# EAGLE design untitled (EAGLE 9.6.2)
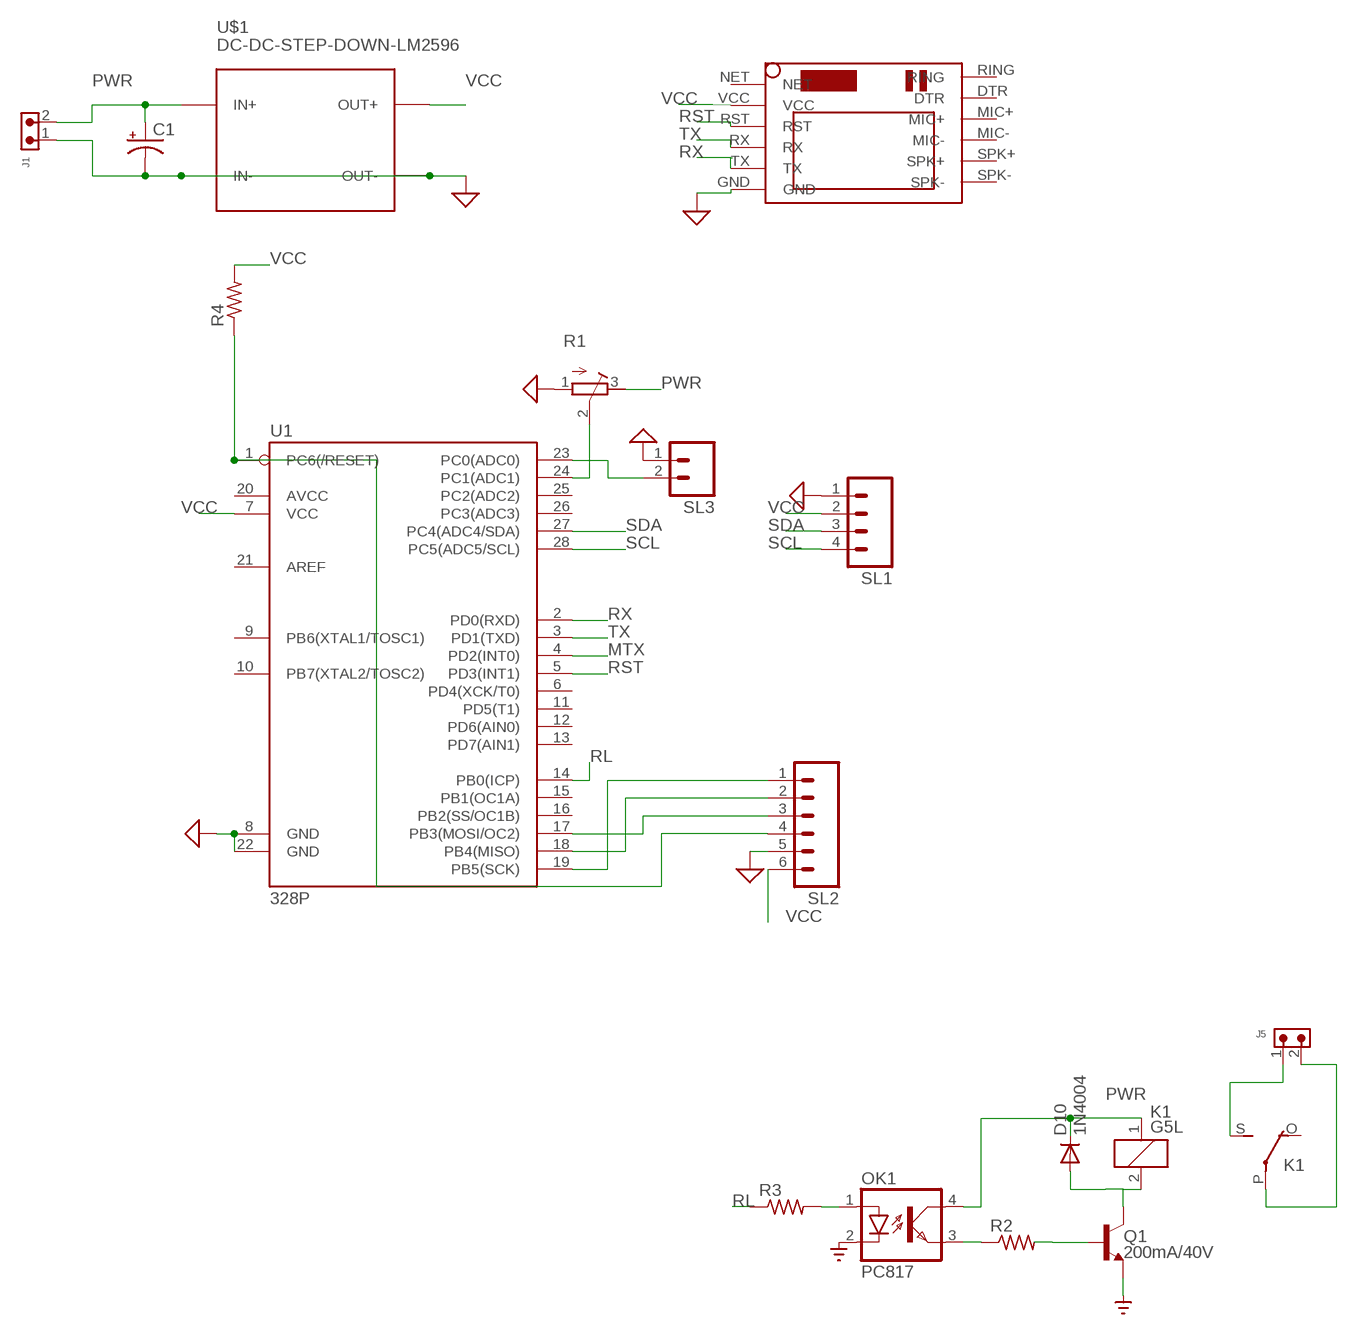
[diagram p0: schematic, sheet 1]

## Parts
C1  CPOL-USE7.5-16  [E7,5-16]
D10  1N4004  [DO41-10]
J1  691305530002  [691305530002]
J5  691305530002  [691305530002]
K1  G5L  [G5LE]
OK1  PC817  [DIL04]
Q1  200mA/40V  TRANS_NPN-2N3904  [TO-92]
R1  R-TRIMM3296Y  [RTRIM3296Y]
R2  R-US_0207/10  [0207/10]
R3  R-US_0207/12  [0207/12]
R4  R-US_0207/10  [0207/10]
SL1  M04  [04P]
SL2  M06  [06P]
SL3  M02  [02P]
U1  328P  ATMEGA328P_PDIP  [DIP28]
U$1  DC-DC-STEP-DOWN-LM2596  [DC-DC-STEP-DOWN-LM2596]
U$2  SIM800LMODULE  [SIM800LMODULE]

## Nets
GND: C1.- J1.1 OK1.2(C) Q1.1(E) R1.1(A) SL1.1 SL2.5 SL3.1 U1.8(GND) U1.22(GND) U$1.IN- U$1.OUT- U$2.GND ; supply symbol labelled SUP, SUPPLY_BRASTAN_GND_
MTX: U1.4(PD2(INT0))
N$1: OK1.1(A) R3.2
N$3: R1.2(S) U1.24(PC1(ADC1))
N$4: SL2.1 U1.19(PB5(SCK))
N$5: SL2.2 U1.18(PB4(MISO))
N$6: SL2.3 U1.17(PB3(MOSI/OC2))
N$7: R4.1 SL2.4 U1.1(PC6(/RESET))
N$8: SL3.2 U1.23(PC0(ADC0))
N$9: D10.A K1.2 Q1.3(C)
N$10: J5.2 K1.P(2:P)
N$11: J5.1 K1.S(2:S)
N$12: Q1.2(B) R2.2
N$13: OK1.3(EMIT) R2.1
PWR: C1.+ D10.C J1.2 K1.1 OK1.4(COL) R1.3(E) U$1.IN+
RL: R3.1 U1.14(PB0(ICP))
RST: U1.5(PD3(INT1)) U$2.RST
RX: U1.2(PD0(RXD)) U$2.TX
SCL: SL1.4 U1.28(PC5(ADC5/SCL))
SDA: SL1.3 U1.27(PC4(ADC4/SDA))
TX: U1.3(PD1(TXD)) U$2.RX
VCC: R4.2 SL1.2 SL2.6 U1.7(VCC) U$1.OUT+ U$2.VCC
Unconnected: K1.O(2:O) U1.6(PD4(XCK/T0)) U1.9(PB6(XTAL1/TOSC1)) U1.10(PB7(XTAL2/TOSC2)) U1.11(PD5(T1)) U1.12(PD6(AIN0)) U1.13(PD7(AIN1)) U1.15(PB1(OC1A)) U1.16(PB2(SS/OC1B)) U1.20(AVCC) U1.21(AREF) U1.25(PC2(ADC2)) U1.26(PC3(ADC3)) U$2.DTR U$2.MIC+ U$2.MIC- U$2.NET U$2.RING U$2.SPK+ U$2.SPK-

## Library data of the parts
C1 = rcl:CPOL-US: POLARIZED CAPACITOR, American symbol; SPICEPREFIX: C
D10 = adafruit:1N4004: DIODE General purpose 1N400x type rectifier (With bigger pads) http://www.ladyada.net/library/pcb/eaglelibrary.html
J1 J5 = Wurth_Connectors_WR-TBL Pluggable Connector:691305530002: WR-TBL Serie 3055 - 5,08 mm - PCB Header Vertical Entry with Plastic Latches KIND PROPERTIES Pitch 5.08 mm MATERIAL PROPERTIES Insulator Material PA66 Insulator Flammability Rating UL94 V-0 Insulator Color Green Terminal Material Copper Alloy Terminal Plating Tin-plated surface GENERAL INFORMATION Operating Temperature -40 up to +105 °C ELECTRICAL PROPERTIES IR UL 16 A Working Voltage [UL] 300 V (AC) Withstanding Voltage [UL] 2500 V (AC) Contact Resistance [UL] 20 mΩ CERTIFICATION UL Approval E315414 <https://www.we-online.com/catalog/media/o135349v209%20Family_WR-TBL3_6913055300xx.jpg> Details see: https://www.we-online.com/catalog/en/TBL_5_08_3055_6913055300XX/ Updated by Ella Wu 2019-12-30 2019(C) Wurth Elektronik; DATASHEET-URL: https://www.we-online.com/catalog/datasheet/691305530002.pdf; IR-UL: 16A; MOUNT: THT; PART-NUMBER: 691305530002; PINS: 2; PITCH: 5.08mm; TYPE: Vertical; WORKING-VOLTAGE-UL: 300V (AC)
K1 = relay:G5L: RELAY 1 x switch, 10 A/120 V AC, 8 A/30 V ADC, Omron; OC_FARNELL: unknown; OC_NEWARK: unknown
OK1 = optocoupler:PC817: SHARP OPTO COUPLER; MPN: PC817X4J000F; OC_FARNELL: 9707727; OC_NEWARK: 97K7059
Q1 = SparkFun-DiscreteSemi:TRANS_NPN: NPN transistor Current controlled devices typically used to amplify current or used as a switch. BC547 - COM-08928 <http://www.sparkfun.com/products/8928> (TO-92 45V 100mA) (1.Collector 2.Base 3.Emitter) 2N3904 - COM-00521 <http://www.sparkfun.com/products/521> (TO-92 40V 200mA) (1.Emitter 2.Base 3.Collector) P2N2222A - COM-12852 <http://www.sparkfun.com/products/12852> (TO-92 40V 600mA) (1.Collector 2.Base 3.Emitter); PROD_ID: TRANS-08447
R1 = rcl:R-TRIMM: Trimm resistor; SPICEMODEL: X; SPICEPREFIXL: POT
R2 R4 = BeagleBone_Black_Wireless:R-US_: RESISTOR, American symbol
R3 = adafruit:R-US_: RESISTOR, American symbol
SL1 = con-amp-quick:M04: AMP QUICK CONNECTOR; OC_FARNELL: unknown; OC_NEWARK: unknown
SL2 = con-amp-quick:M06: AMP QUICK CONNECTOR; OC_FARNELL: unknown; OC_NEWARK: unknown
SL3 = con-amp-quick:M02: AMP QUICK CONNECTOR; OC_FARNELL: unknown; OC_NEWARK: unknown
U1 = SparkFun-IC-Microcontroller:ATMEGA328P_PDIP: Atmel 328P Through hole ATMEGA328P uC used in the Arduino 32kb flash, 1k EEPROM, 2k SRAM Datasheet <http://www.sparkfun.com/datasheets/Components/SMD/ATMega328.pdf> SparkFun Products Storefront component: AVR 28 Pin 20MHz 32K 6A/D - ATMega328P <https://www.sparkfun.com/products/9061> (COM-09061) SparkFun Simon Says - Through-Hole Soldering Kit <https://www.sparkfun.com/products/10547> (KIT-10547) SparkFun Learn to Solder - Simon Says <https://www.sparkfun.com/products/13708> (KIT-13708) SparkFun BigTime Watch Kit <https://www.sparkfun.com/products/11734> (KIT-11734) SparkFun ClockIt <https://www.sparkfun.com/products/10930> (KIT-10930) SparkFun Serial Enabled LCD Kit <https://www.sparkfun.com/products/10097> (LCD-10097) SparkFun Simon Tilts - Through Hole Soldering Kit <https://www.sparkfun.com/products/12634> (KIT-12634) SparkFun Frequency Counter Kit <https://www.sparkfun.com/products/10140> (KIT-10140) FabFM Radio Kit <https://www.sparkfun.com/products/11043> (KIT-11043) SparkFun Binary Blaster Kit <https://www.sparkfun.com/products/12037> (KIT-12037) SparkFun Metro-Gnome <https://www.sparkfun.com/products/9236> (KIT-09236) ATmega328 with Arduino Optiboot (Uno) <https://www.sparkfun.com/products/10524> (DEV-10524); PROD_ID: IC-09136
U$1 = diy-modules:DC-DC-STEP-DOWN-LM2596: DC/DC Step-Down Regulator based on LM2596-ADJ chip LM2596 datasheet available here: http://www.ti.com/lit/ds/symlink/lm2596.pdf Click here to find device on ebay.com <http://www.ebay.com/sch/lm2596+power+regulator>
U$2 = SIM800LMODULE:SIM800LMODULE: SIM800L Module

## Board
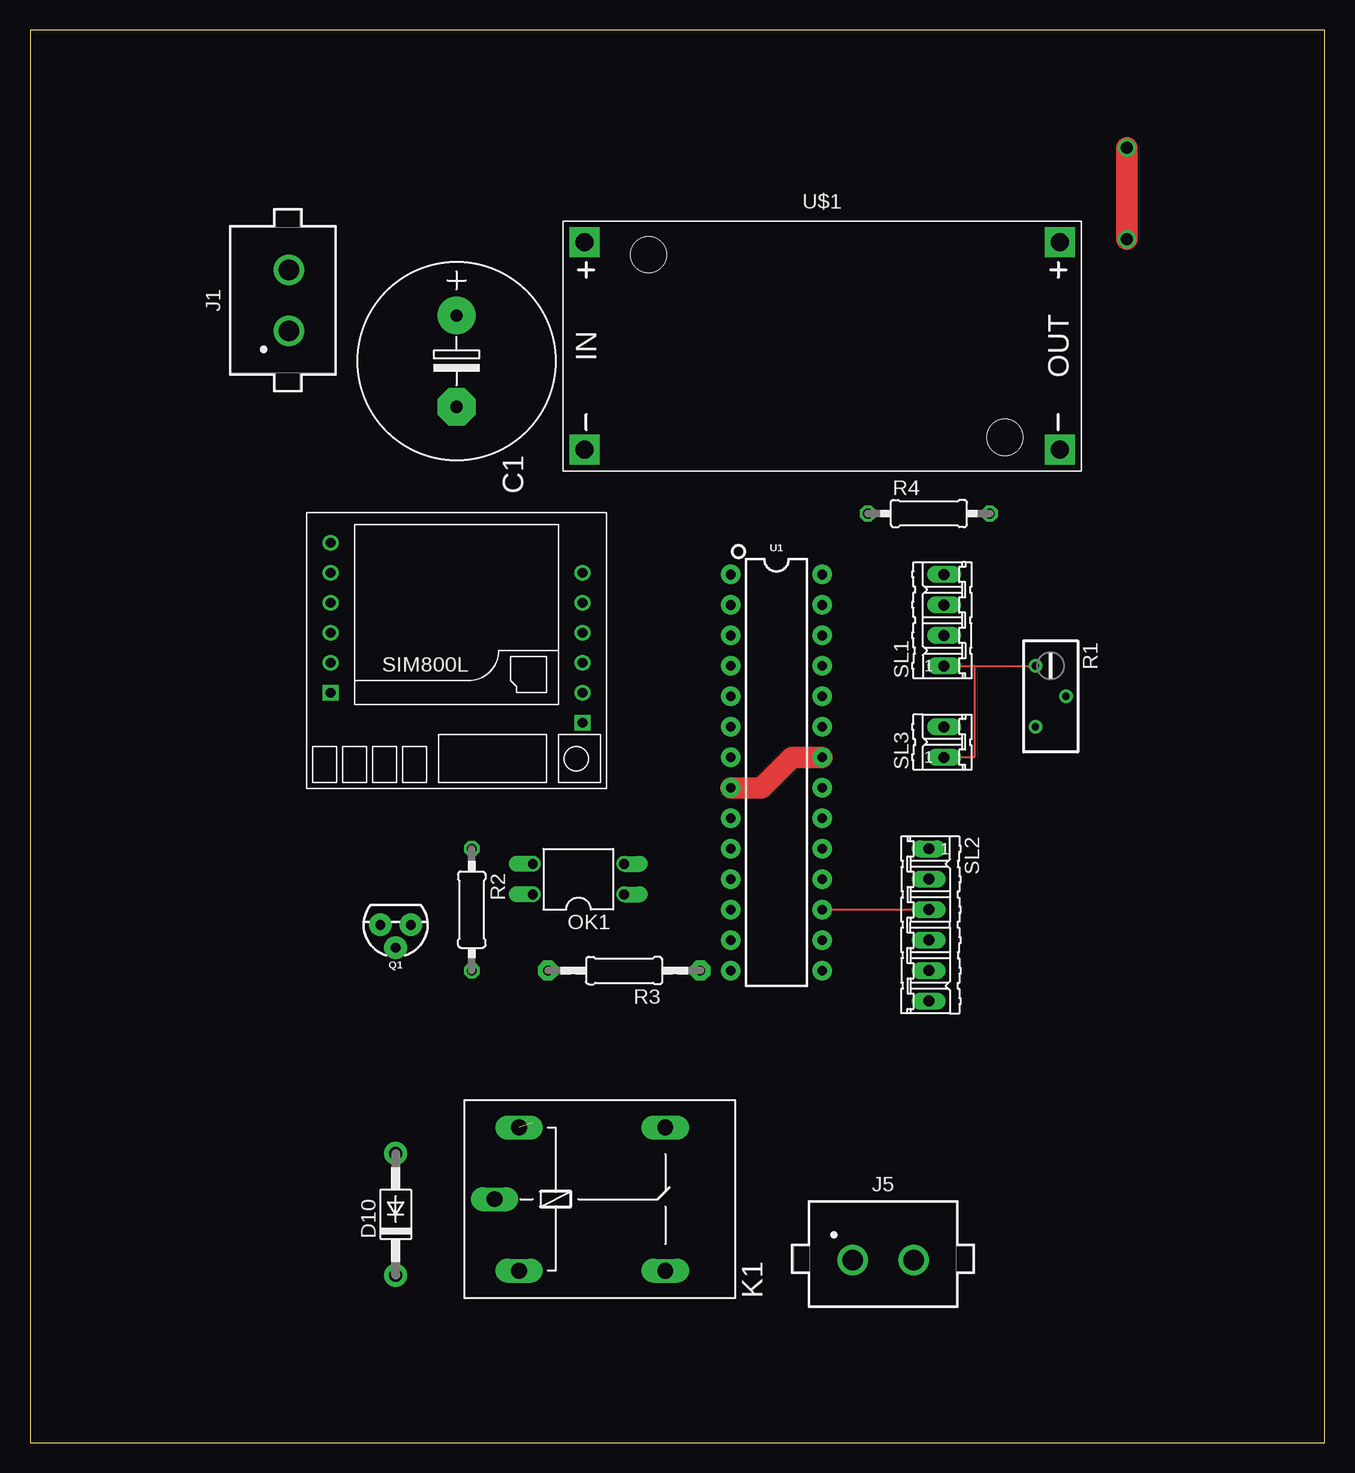
[diagram p1: board, top side]
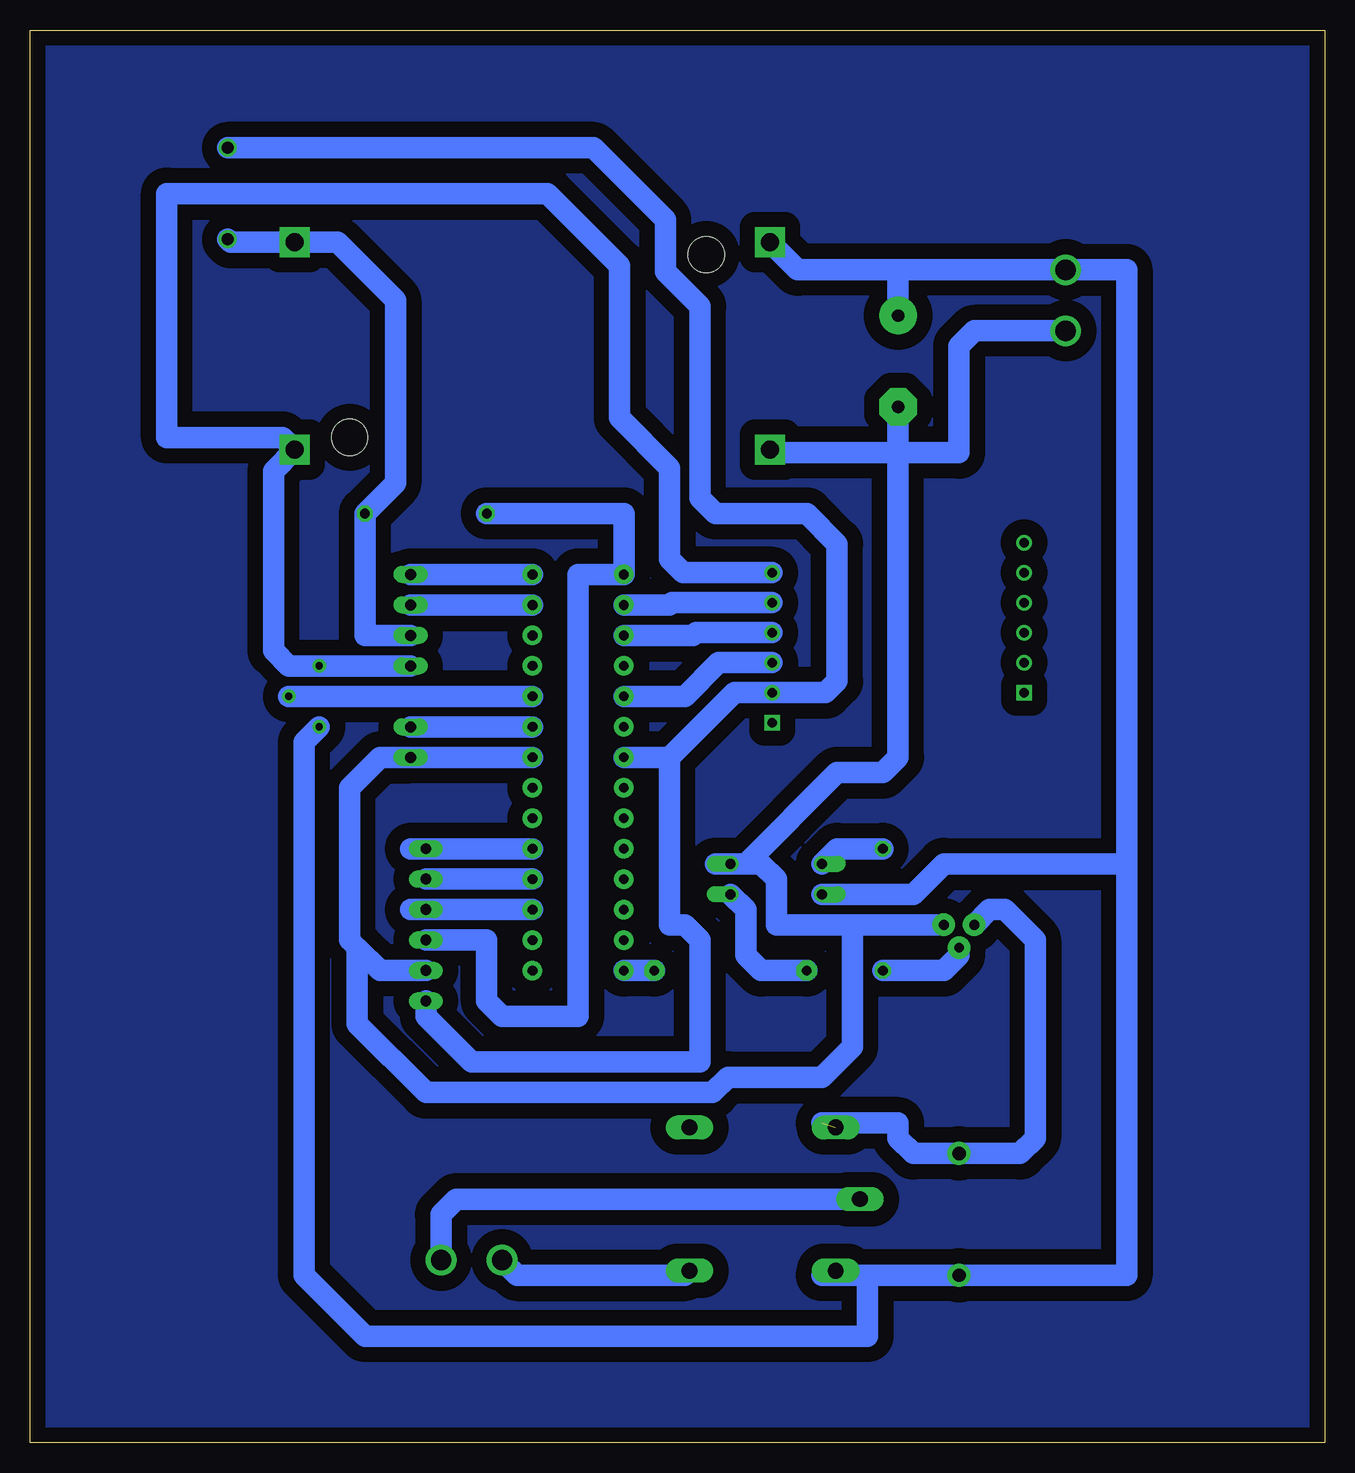
[diagram p2: board, bottom side, seen from below]

Size 107.93 x 117.78 mm. Coordinates in mm from the lower left corner, seen from the top.
Outline: 0,0 107.93,0 107.93,117.78 0,117.78 0,0
Copper layers (1*16): Top 0.035mm / dielectric 1.5mm / Bottom 0.035mm
Design rules "default *": minimum track width 6mil, minimum drill 0.35mm, track to track 30mil, track to pad 30mil, pad to pad 30mil, via to via 30mil, smd to smd 6mil, copper to edge 40mil, drill to drill 6mil, minimum pad ring 10mil, minimum via ring 8mil, stop-mask expansion 4mil, vias tented up to drill 0mil, thermal gap 10mil

### Footprints (pad centres in the part's own frame; a part is rotated, then mirrored left to right if it is on the bottom)
E7,5-16 = drill 1.016 pad 3.15: + -3.81,0 | drill 1.016 pad 3.15 octagon: - 3.81,0
DO41-10 = drill 1.118 pad 1.93: A 5.08,0; C -5.08,0
691305530002 = drill 1.7: 1 -2.54,0; 2 2.54,0
G5LE = drill 1.321 long: 1 -7.493,-5.969; 2 -7.493,5.969; O 4.699,5.969; P -9.525,0; S 4.699,-5.969
DIL04 = drill 0.813 offset: 1 -1.27,-3.81; 2 1.27,-3.81; 3 1.27,3.81; 4 -1.27,3.81
TO-92 = drill 0.813 pad 1.88: 1 -1.27,0; 2 0,1.905; 3 1.27,0
RTRIM3296Y = drill 0.61: 1 1.27,-2.54; 2 -1.27,0; 3 1.27,2.54
0207/10 = drill 0.813 octagon: 1 -5.08,0; 2 5.08,0
0207/12 = drill 0.813 pad 1.676 octagon: 1 -6.35,0; 2 6.35,0
04P = drill 0.914 long: 1 -3.81,0; 2 -1.27,0; 3 1.27,0; 4 3.81,0
06P = drill 0.914 long: 1 -6.35,0; 2 -3.81,0; 3 -1.27,0; 4 1.27,0; 5 3.81,0; 6 6.35,0
02P = drill 0.914 long: 1 -1.27,0; 2 1.27,0
DIP28 = drill 0.813 pad 1.626: 1 -16.51,-3.81; 2 -13.97,-3.81; 3 -11.43,-3.81; 4 -8.89,-3.81; 5 -6.35,-3.81; 6 -3.81,-3.81; 7 -1.27,-3.81; 8 1.27,-3.81; 9 3.81,-3.81; 10 6.35,-3.81; 11 8.89,-3.81; 12 11.43,-3.81; 13 13.97,-3.81; 14 16.51,-3.81; 15 16.51,3.81; 16 13.97,3.81; 17 11.43,3.81; 18 8.89,3.81; 19 6.35,3.81; 20 3.81,3.81; 21 1.27,3.81; 22 -1.27,3.81; 23 -3.81,3.81; 24 -6.35,3.81; 25 -8.89,3.81; 26 -11.43,3.81; 27 -13.97,3.81; 28 -16.51,3.81
DC-DC-STEP-DOWN-LM2596 = drill 1.5 pad 2.5 square: IN+ -19.812,8.636; IN- -19.812,-8.636; OUT+ 19.812,8.636; OUT- 19.812,-8.636 | hole 3: -14.478,7.62; 15.24,-7.62
SIM800LMODULE = drill 0.8: DTR 10.5,1; GND -10.5,-6.5; MIC+ 10.5,-1.5; MIC- 10.5,-4; RST -10.5,1; RX -10.5,-1.5; SPK+ 10.5,-6.5; SPK- 10.5,-9; TX -10.5,-4; VCC -10.5,3.5 | drill 0.8 square: NET -10.5,6; RING 10.5,3.5

### Placement (x,y rotation side)
C1  35.56,90.17 270 top
D10  30.48,19.05 90 top
J1  21.59,95.25 90 top
J5  71.12,15.24 0 top
K1  48.26,20.32 0 top
OK1  45.72,46.99 90 top
Q1  30.48,43.18 180 top
R1  85.09,62.23 180 top
R2  36.83,44.45 270 top
R3  49.53,39.37 180 top
R4  74.93,77.47 0 top
SL1  76.2,68.58 90 top
SL2  74.93,43.18 270 top
SL3  76.2,58.42 90 top
U1  62.23,55.88 270 top
U$1  66.04,91.44 0 top
U$2  35.56,66.04 180 top

### Tracks (layer width: path | path; a pad name or v marks a point on that pad's centre or on a via)
GND
  Top 0.152: 46.35,73.02 U$2.GND | 46.35,82.55 U$1.IN- | SL1.1 78.74,64.77 | 78.74,64.77 R1.1 | 85.73,82.55 U$1.OUT- | SL3.1 78.74,57.15 78.74,64.77
  Top 1.778: U1.8 60.96,54.61 63.5,57.15 U1.22
  Bottom 1.778: SL1.1 R1.1 86.36,64.77 87.63,66.04 87.63,81.03 U$1.OUT- 86.87,83.82 96.52,83.82 96.52,104.14 64.77,104.14 58.78,98.15 58.78,85.45 54.61,81.28 54.61,73.66 53.49,72.54 U$2.GND | U1.22 SL3.1 78.74,57.15 81.28,54.61 81.28,41.91 80.65,41.27 | SL2.5 78.74,39.37 80.65,41.27 | Q1.1 39.37,43.18 | 39.37,43.18 45.72,43.18 45.72,46.99 46.99,48.26 48.26,48.26 | 48.26,48.26 OK1.2 50.8,48.26 | 80.65,41.27 80.65,34.92 74.93,29.21 51.02,29.21 49.75,30.48 41.91,30.48 39.37,33.02 39.37,43.18 | 48.26,48.26 40.64,55.88 36.83,55.88 35.56,57.15 35.56,82.55 | J1.1 29.21,92.71 30.48,91.44 30.48,82.55 35.56,82.55 | U$1.IN- 45.97,82.55 35.56,82.55 | C1.- 35.56,82.55
N$1
  Bottom 1.778: R3.2 46.99,39.37 48.26,40.64 48.26,44.45 OK1.1
N$2
  pour Bottom (isolate 1.27): 0,118.11 107.95,118.11 107.95,0 0,0
N$3
  Bottom 1.778: U1.24 R1.2
N$4
  Bottom 1.778: U1.19 SL2.1 76.2,49.53
N$5
  Bottom 1.778: SL2.2 U1.18
N$6
  Top 0.152: U1.17 SL2.3
  Bottom 1.778: U1.17 76.2,44.45
N$7
  Bottom 1.778: SL2.4 69.85,41.91 69.85,36.83 68.58,35.56 62.23,35.56 62.23,72.39 U1.1 58.42,77.47 R4.1
N$8
  Bottom 1.778: U1.23 SL3.2
N$9  (1 unrouted)
  Top 0.152: 28.57,42.55 Q1.3 | 40.64,26.67 K1.2
  Bottom 1.778: Q1.3 27.94,44.45 26.67,44.45 24.13,41.91 24.13,25.4 25.4,24.13 D10.A 34.29,24.13 35.56,25.4 35.56,26.67 41.91,26.67
N$10
  Bottom 1.778: K1.P 72.39,20.32 73.66,19.05 J5.2
N$11
  Bottom 1.778: J5.1 67.31,13.97 53.34,13.97 K1.S
N$12
  Bottom 1.778: R2.2 31.75,39.37 30.48,40.64 Q1.2
N$13
  Bottom 1.778: OK1.3 40.64,49.53 R2.1
PWR
  Bottom 1.778: U$1.IN+ 43.94,97.79 35.56,97.79 | 35.56,97.79 J1.2 16.51,97.79 16.51,48.26 | C1.+ 35.56,97.79 | 16.51,48.26 16.51,13.97 D10.C 38.1,13.97 | 38.1,13.97 40.64,13.97 | 40.64,13.97 41.91,13.97 | K1.1 40.77,14.1 40.64,13.97 | OK1.4 34.29,45.72 31.75,48.26 16.51,48.26 | 38.1,13.97 38.1,8.89 80.01,8.89 85.09,13.97 85.09,58.42 R1.3
RL
  Bottom 1.778: R3.1 U1.14
RST
  Bottom 1.778: U$2.RST 50.53,65.04 53.34,62.23 U1.5
RX
  Bottom 1.778: U$2.TX 54.42,70.04 54.61,69.85 U1.2
SCL
  Bottom 1.778: U1.28 SL1.4
SDA
  Bottom 1.778: SL1.3 U1.27
TX
  Bottom 1.778: U$2.RX 52.41,67.54 52.64,67.31 U1.3
VCC  (via drill 1)
  Top 1.778: v91.44,107.95 v91.44,100.33
  Bottom 1.778: 54.61,57.15 49.22,62.54 U$2.VCC 41.6,62.54 40.64,63.5 40.64,74.93 43.18,77.47 50.8,77.47 52.07,78.74 52.07,94.75 54.97,97.65 54.97,101.96 60.96,107.95 v91.44,107.95 | 54.61,57.15 U1.7 | SL1.2 80.01,67.31 R4.2 77.47,80.01 77.47,95.25 82.3,100.08 U$1.OUT+ 91.19,100.08 v91.44,100.33 | SL2.6 74.93,35.56 71.12,31.75 52.07,31.75 52.07,41.91 53.34,43.18 54.61,43.18 54.61,57.15